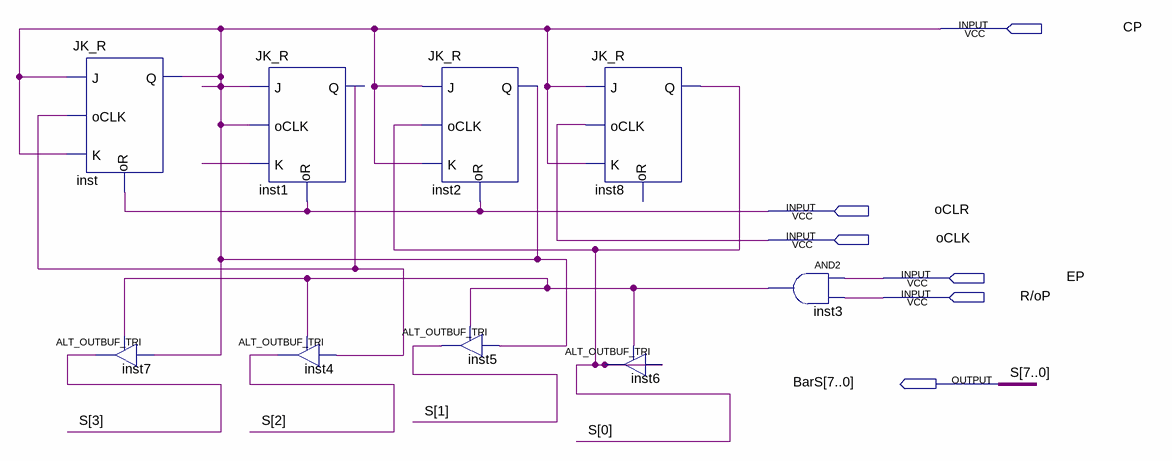
[diagram p0: schematic sheet]
// Quartus schematic Contador_Binario.bdf as structural Verilog: 9 symbols, 6 pins
module Contador_Binario (
  input  CP,
  input  oCLR,
  input  oCLK,
  input  EP,
  input  \R/oP ,
  output [7:0] BarS
);

  wire inst1_q, inst3_out, undriven;

  JK_R inst (.J(CP), .oCLK(inst1_q), .K(CP), .oR(oCLR), .Q(CP));
  ALT_OUTBUF_TRI inst7 (.i(CP), .oe(inst3_out), .o(BarS[3]));
  JK_R inst1 (.J(CP), .oCLK(CP), .K(undriven), .oR(oCLR), .Q(inst1_q));
  ALT_OUTBUF_TRI inst4 (.i(inst1_q), .oe(inst3_out), .o(BarS[2]));
  JK_R inst2 (.J(CP), .oCLK(BarS[0]), .K(CP), .oR(oCLR), .Q(CP));
  ALT_OUTBUF_TRI inst5 (.i(CP), .oe(inst3_out), .o(BarS[1]));
  JK_R inst8 (.J(CP), .oCLK(oCLK), .K(CP), .Q(BarS[0]));  // open: oR
  ALT_OUTBUF_TRI inst6 (.i(BarS[0]), .oe(inst3_out), .o(BarS[0]));
  and inst3 (inst3_out, EP, \R/oP );

  // Other names for the same wires on the sheet: S[7:0] = BarS
endmodule
